# EAGLE design ESP8266 (EAGLE 7.2.0)
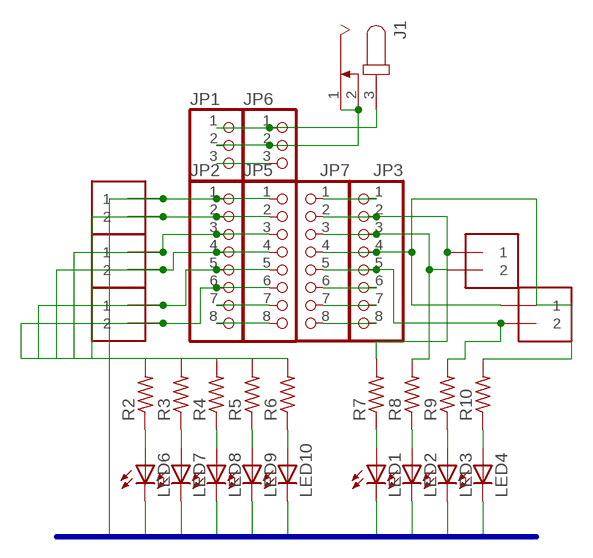
[diagram p0: schematic, sheet 1]

## Parts
J1  JACK-PLUG0  [SPC4077]
J2  1X2-3.5MM  [1X2-3.5MM]
J3  1X2-3.5MM  [1X2-3.5MM]
J4  1X2-3.5MM  [1X2-3.5MM]
J7  1X2-3.5MM  [1X2-3.5MM]
J8  1X2-3.5MM  [1X2-3.5MM]
JP1  PINHD-1X3  [1X03]
JP2  PINHD-1X8BIG  [1X08-BIG]
JP3  PINHD-1X8BIG  [1X08-BIG]
JP5  PINHD-1X8BIG  [1X08-BIG]
JP6  PINHD-1X3  [1X03]
JP7  PINHD-1X8BIG  [1X08-BIG]
LED1  LEDCHIP-LED0805  [CHIP-LED0805]
LED2  LEDCHIP-LED0805  [CHIP-LED0805]
LED3  LEDCHIP-LED0805  [CHIP-LED0805]
LED4  LEDCHIP-LED0805  [CHIP-LED0805]
LED6  LEDCHIP-LED0805  [CHIP-LED0805]
LED7  LEDCHIP-LED0805  [CHIP-LED0805]
LED8  LEDCHIP-LED0805  [CHIP-LED0805]
LED9  LEDCHIP-LED0805  [CHIP-LED0805]
LED10  LEDCHIP-LED0805  [CHIP-LED0805]
R2  R-US_R0805  [R0805]
R3  R-US_R0805  [R0805]
R4  R-US_R0805  [R0805]
R5  R-US_R0805  [R0805]
R6  R-US_R0805  [R0805]
R7  R-US_R0805  [R0805]
R8  R-US_R0805  [R0805]
R9  R-US_R0805  [R0805]
R10  R-US_R0805  [R0805]

## Nets
GND: J1.1 J1.2 J2.1 JP1.2 JP2.1 JP5.1 JP6.2 LED1.C LED2.C LED3.C LED4.C LED6.C LED7.C LED8.C LED9.C LED10.C
N$1: J7.1 JP3.2 JP7.2 R7.2
N$3: J8.1 JP3.4 JP7.4 R10.2
N$4: J7.2 JP3.3 JP7.3 R8.2
N$6: J2.2 JP2.2 JP5.2 R2.2
N$7: J3.1 JP2.3 JP5.3 R3.2
N$8: J3.2 JP2.4 JP5.4 R4.2
N$9: J4.1 JP2.5 JP5.5 R5.2
N$10: J4.2 JP2.6 JP5.6 R6.2
N$11: J1.3 JP1.1 JP6.1
N$13: JP1.3 JP6.3
N$14: JP2.7 JP5.7
N$15: JP2.8 JP5.8
N$16: JP3.1 JP7.1
N$17: JP3.6 JP7.6
N$18: JP3.7 JP7.7
N$19: JP3.8 JP7.8
N$20: J8.2 JP3.5 JP7.5 R9.2
N$23: LED6.A R2.1
N$24: LED7.A R3.1
N$25: LED8.A R4.1
N$26: LED9.A R5.1
N$27: LED10.A R6.1
N$28: LED1.A R7.1
N$29: LED2.A R8.1
N$30: LED3.A R9.1
N$31: LED4.A R10.1

## Buses
GND

## Library data of the parts
J1 = con-jack:JACK-PLUG: DC POWER JACK Power Jack, DC, Right Angle, Through Hole, Rated 5A at 16VDC, PC Terminals Distributor: Farnell (www.Farnell.de) Drawing: 84N1161.pdf / 84N1162.pdf Manufacturer: SPC Technology (www.spctechnology.com) Type: SPC4077 / SPC 4078; OC_FARNELL: unknown; OC_NEWARK: unknown
J2-J4 J7 J8 = adafruit:1X2: 3.5mm Terminal block http://www.ladyada.net/library/pcb/eaglelibrary.html
JP1 JP6 = adafruit:PINHD-1X3: PIN HEADER
JP2 JP3 JP5 JP7 = adafruit:PINHD-1X8: PIN HEADER
LED1-LED4 LED6-LED10 = adafruit:LED: LED OSRAM: - CHIPLED LG R971, LG N971, LY N971, LG Q971, LY Q971, LO R971, LY R971 LH N974, LH R974 LS Q976, LO Q976, LY Q976 LO Q996 - Hyper CHIPLED LW Q18S LB Q993, LB Q99A, LB R99A - SideLED LS A670, LO A670, LY A670, LG A670, LP A670 LB A673, LV A673, LT A673, LW A673 LH A674 LY A675 LS A676, LA A676, LO A676, LY A676, LW A676 LS A679, LY A679, LG A679 - Hyper Micro SIDELED® LS Y876, LA Y876, LO Y876, LY Y876 LT Y87S - SmartLED LW L88C, LW L88S LB L89C, LB L89S, LG L890 LS L89K, LO L89K, LY L89K LS L896, LA L896, LO L896, LY L896 - TOPLED LS T670, LO T670, LY T670, LG T670, LP T670 LSG T670, LSP T670, LSY T670, LOP T670, LYG T670 LG T671, LOG T671, LSG T671 LB T673, LV T673, LT T673, LW T673 LH T674 LS T676, LA T676, LO T676, LY T676, LB T676, LH T676, LSB T676, LW T676 LB T67C, LV T67C, LT T67C, LS T67K, LO T67K, LY T67K, LW E67C LS E67B, LA E67B, LO E67B, LY E67B, LB E67C, LV E67C, LT E67C LW T67C LS T679, LY T679, LG T679 LS T770, LO T770, LY T770, LG T770, LP T770 LB T773, LV T773, LT T773, LW T773 LH T774 LS E675, LA E675, LY E675, LS T675 LS T776, LA T776, LO T776, LY T776, LB T776 LHGB T686 LT T68C, LB T68C - Hyper Mini TOPLED® LB M676 - Mini TOPLED Santana® LG M470 LS M47K, LO M47K, LY M47K Source: http://www.osram.convergy.de/
R2-R10 = adafruit:R-US_: RESISTOR, American symbol

## Board
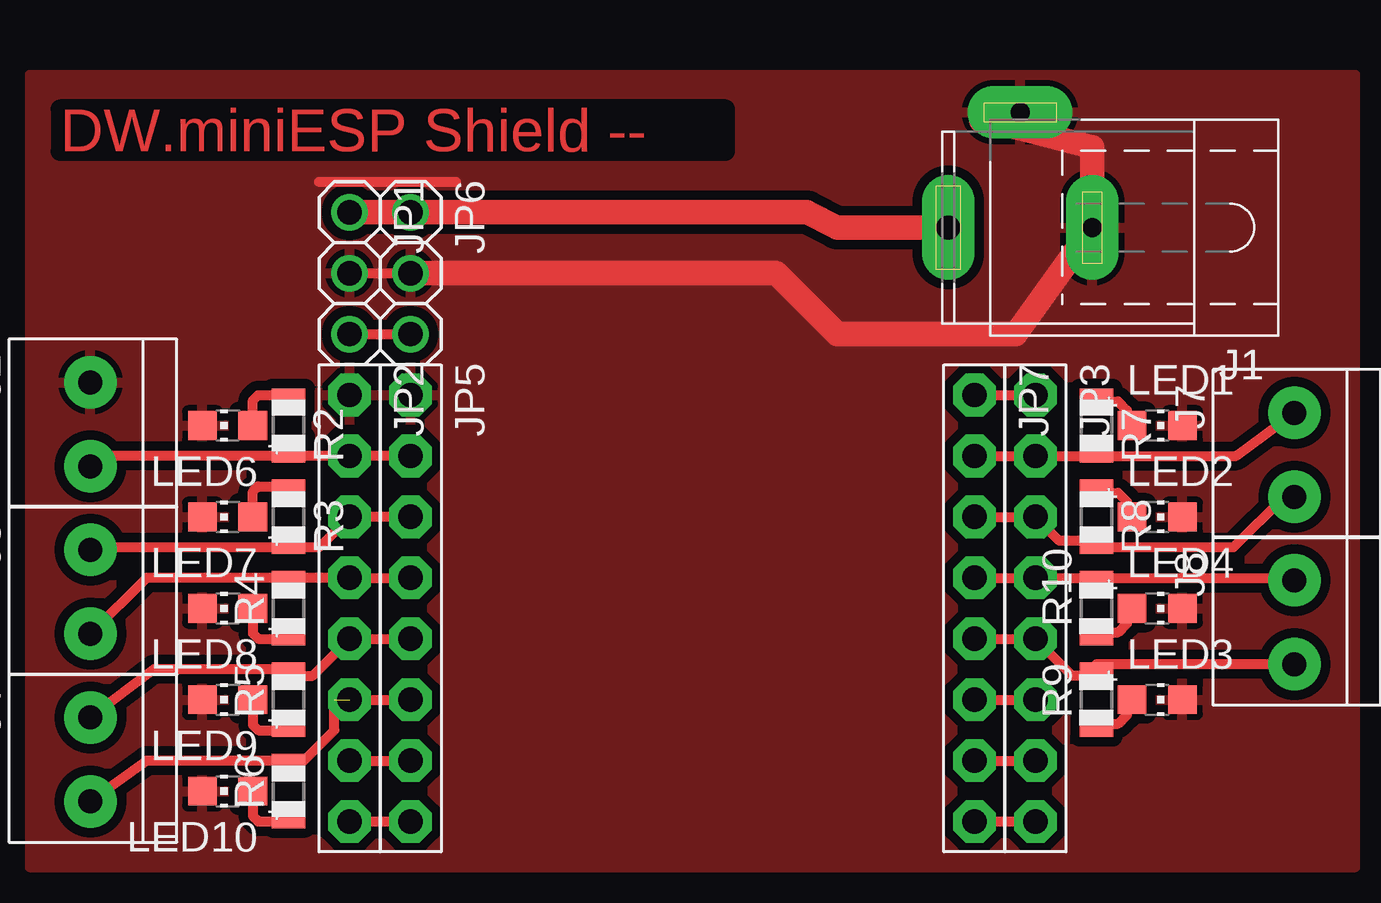
[diagram p1: board, top side]

No outline drawn. Coordinates in mm, seen from the top.
Copper layers (1*16): Top 0.035mm / dielectric 1.5mm / Bottom 0.035mm
Design rules "default": minimum track width 10mil, minimum drill 24mil, track to track 8mil, track to pad 8mil, pad to pad 8mil, via to via 8mil, smd to smd 8mil, copper to edge 40mil, drill to drill 8mil, minimum pad ring 10mil, minimum via ring 8mil, stop-mask expansion 4mil, vias tented up to drill 0mil, thermal gap 10mil

### Footprints (pad centres in the part's own frame; a part is rotated, then mirrored left to right if it is on the bottom)
SPC4077 = drill 0.8 pad 2.184 long: 1 -3,0; 2 0,-4.8 | drill 1 pad 2.184 long: 3 3,0
1X2-3.5MM = drill 1 pad 2.184: 1 1.8,0; 2 -1.7,0
1X03 = drill 1.016: 1 -2.54,0; 2 0,0; 3 2.54,0
1X08-BIG = drill 1.016 pad 1.778 octagon: 1 -8.89,0; 2 -6.35,0; 3 -3.81,0; 4 -1.27,0; 5 1.27,0; 6 3.81,0; 7 6.35,0; 8 8.89,0
CHIP-LED0805 = smd 1.2 x 1.2: A 0,-1.05; C 0,1.05
R0805 = smd 1.1 x 1.4: 1 -1,0; 2 1,0

### Placement (x,y rotation side)
J1  41.27,26.67 180 top
J2  2.54,18.41 90 top
J3  2.54,11.43 90 top
J4  2.54,4.45 90 top
J7  52.7,17.14 90 top
J8  52.7,10.16 90 top
JP1  13.34,24.77 270 top
JP2  13.34,10.79 270 top
JP3  41.91,10.79 270 top
JP5  15.88,10.79 270 top
JP6  15.88,24.77 270 top
JP7  39.37,10.79 270 top
LED1  46.99,18.41 270 top
LED2  46.99,14.61 270 top
LED3  46.99,6.99 270 top
LED4  46.99,10.79 270 top
LED6  8.26,18.41 90 top
LED7  8.26,14.61 90 top
LED8  8.26,10.79 90 top
LED9  8.26,6.99 90 top
LED10  8.26,3.17 90 top
R2  10.79,18.41 270 top
R3  10.79,14.61 270 top
R4  10.79,10.79 90 top
R5  10.79,6.99 90 top
R6  10.79,3.17 90 top
R7  44.45,18.41 270 top
R8  44.45,14.61 270 top
R9  44.45,6.99 90 top
R10  44.45,10.79 90 top

### Tracks (layer width: path | path; a pad name or v marks a point on that pad's centre or on a via)
GND
  Top 0.406: 12.06,28.57 17.78,28.57 | JP1.2 JP6.2
  Top 1.016: J1.2 39.65,31.11 40.01,31.11 44.27,30.02 J1.1 41.1,22.23 33.66,22.23 31.11,24.77 JP6.2
  pour Top (isolate 0.4): 0,0 55.24,0 55.24,33.02 0,33.02
N$1
  Top 0.406: JP7.2 JP3.2 44.45,17.14 | 44.45,17.14 50.27,17.14 J7.1 | R7.2 44.45,17.14
N$3
  Top 0.406: JP3.4 42.27,12.06 | JP3.4 44.45,12.06 | 44.45,12.06 52.6,12.06 J8.1 | JP7.4 JP3.4 | R10.2 44.45,12.06
N$4
  Top 0.406: JP7.3 JP3.3 42.91,13.61 R8.2 44.72,13.34 50.16,13.34 52.27,15.45 J7.2
N$6
  Top 0.406: JP5.2 JP2.2 10.79,17.14 | 10.79,17.14 2.97,17.14 J2.2 | R2.2 10.79,17.14
N$7
  Top 0.406: JP5.3 JP2.3 12.06,13.34 11.06,13.34 R3.2 10.79,13.34 2.65,13.34 J3.1
N$8
  Top 0.406: JP5.4 JP2.4 11.06,12.06 R4.2 10.79,12.06 4.88,12.06 J3.2
N$9
  Top 0.406: JP5.5 JP2.5 11.79,7.99 R5.2 10.79,8.26 5.18,8.26 J4.1
N$10  (1 unrouted)
  Top 0.406: R6.2 10.79,4.45 | 10.79,4.45 4.88,4.45 J4.2 | 10.79,4.45 11.43,4.45 12.7,5.71 12.7,6.99 JP5.6
N$11
  Top 0.406: JP1.1 JP6.1
  Top 1.016: J1.3 33.66,26.67 32.38,27.3 JP1.1
N$13
  Top 0.406: JP1.3 JP6.3
N$14
  Top 0.406: JP2.7 JP5.7
N$15
  Top 0.406: JP2.8 JP5.8
N$16
  Top 0.406: JP7.1 JP3.1
N$17
  Top 0.406: JP7.6 JP3.6
N$18
  Top 0.406: JP7.7 JP3.7
N$19
  Top 0.406: JP7.8 JP3.8
N$20
  Top 0.406: JP7.5 JP3.5 43.45,7.99 R9.2 | R9.2 44.45,7.62 | J8.2 44.45,8.46 R9.2
N$23
  Top 0.406: LED6.A 9.3,19.46 9.53,19.68 10.53,19.68 R2.1
N$24
  Top 0.406: LED7.A 9.3,15.65 9.53,15.88 10.53,15.88 R3.1
N$25
  Top 0.406: LED8.A 9.3,9.74 9.53,9.53 10.53,9.53 R4.1
N$26
  Top 0.406: LED9.A 9.3,5.93 9.53,5.71 10.53,5.71 R5.1
N$27
  Top 0.406: LED10.A 9.3,2.12 9.53,1.91 10.53,1.91 R6.1
N$28
  Top 0.406: R7.1 45.35,19.41 45.72,19.05 45.72,18.64 LED1.A
N$29
  Top 0.406: R8.1 45.35,15.61 45.72,15.24 45.72,14.82 LED2.A
N$30
  Top 0.406: R9.1 45.35,5.99 45.72,6.35 45.72,6.76 LED3.A
N$31
  Top 0.406: R10.1 45.35,9.79 45.72,10.16 45.72,10.57 LED4.A

### Text on the board
Top: DW.miniESP Shield | DW.miniESP Shield --